# Altium schematic sheet NVME.SchDoc
size B; SheetNumber: 9; SheetTotal: 10
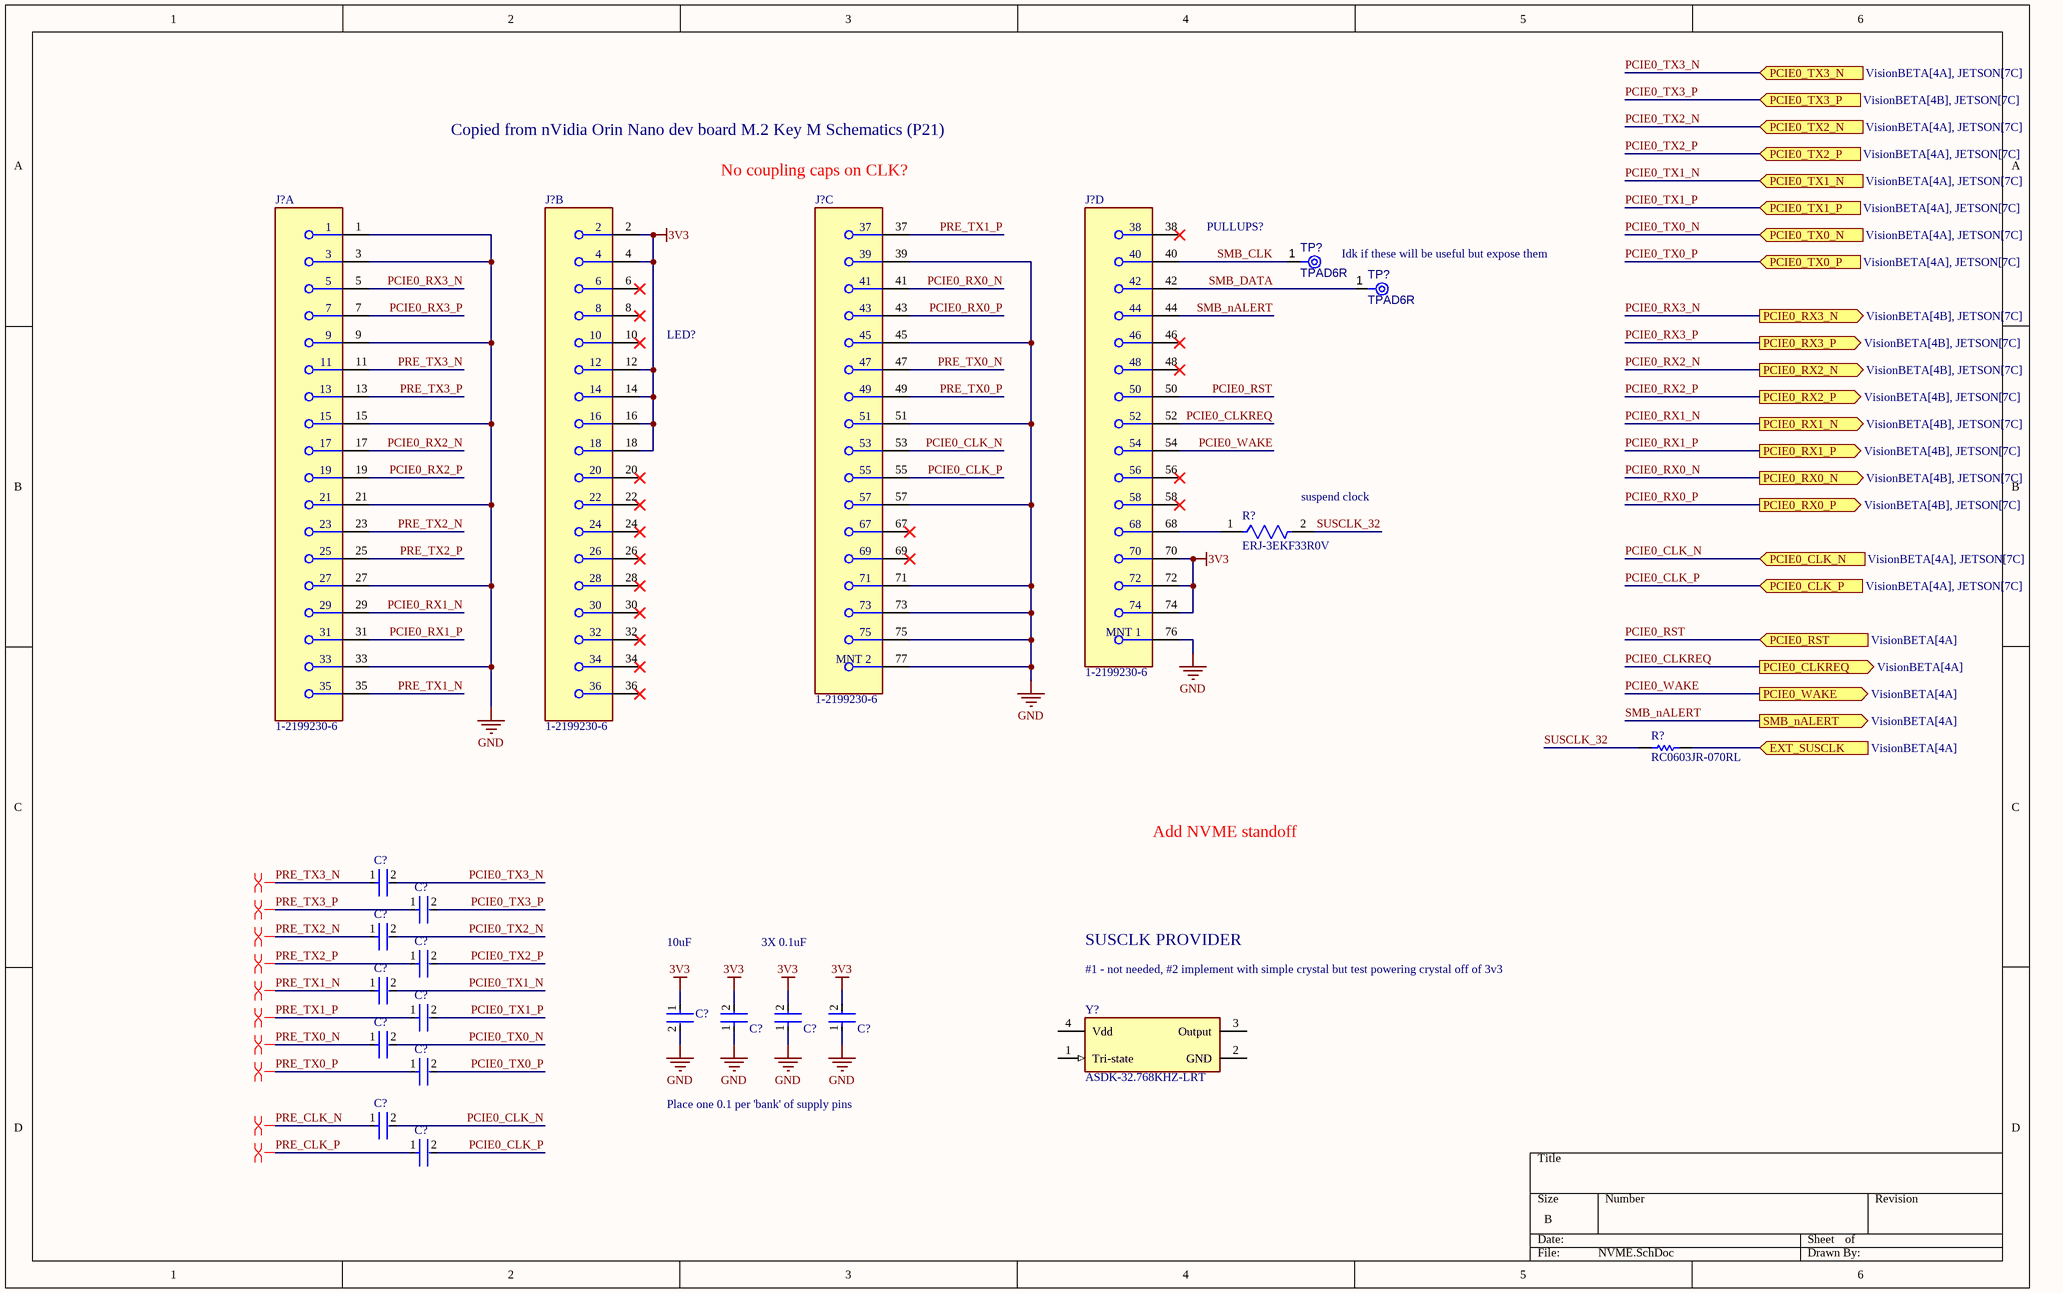
[diagram p0: NVME.SchDoc]

## Parts
(Parts that share a designator on the sheet are numbered #1, #2 ... from top to bottom, then left to right.)
C?#1  C1005X7R1A224K050BB  [FP-C1005-050-0_05-IPC_C]  (value not drawn)
C?#2  C1005X7R1A224K050BB  [FP-C1005-050-0_05-IPC_C]  (value not drawn)
C?#3  C1005X7R1A224K050BB  [FP-C1005-050-0_05-IPC_C]  (value not drawn)
C?#4  C1005X7R1A224K050BB  [FP-C1005-050-0_05-IPC_C]  (value not drawn)
C?#5  C1005X7R1A224K050BB  [FP-C1005-050-0_05-IPC_C]  (value not drawn)
C?#6  GRM188R60J106ME47D  [FP-GRM188-0_1-e0_2_0_55-IPC_A]  (value not drawn)
C?#7  C1005X7R1A224K050BB  [FP-C1005-050-0_05-IPC_C]  (value not drawn)
C?#8  C1005X7R1H104K050BB  [FP-C1005-050-0_05-IPC_C]  (value not drawn)
C?#9  C1005X7R1H104K050BB  [FP-C1005-050-0_05-IPC_C]  (value not drawn)
C?#10  C1005X7R1H104K050BB  [FP-C1005-050-0_05-IPC_C]  (value not drawn)
C?#11  C1005X7R1A224K050BB  [FP-C1005-050-0_05-IPC_C]  (value not drawn)
C?#12  C1005X7R1A224K050BB  [FP-C1005-050-0_05-IPC_C]  (value not drawn)
C?#13  C1005X7R1A224K050BB  [FP-C1005-050-0_05-IPC_C]  (value not drawn)
C?#14  C1005X7R1A224K050BB  [FP-C1005-050-0_05-IPC_C]  (value not drawn)
J?#1  1-2199230-6  [FP-1-2199230-6-MFG]  (part A of 4)
J?#2  1-2199230-6  [FP-1-2199230-6-MFG]  (part B of 4)
J?#3  1-2199230-6  [FP-1-2199230-6-MFG]  (part C of 4)
J?#4  1-2199230-6  [FP-1-2199230-6-MFG]  (part D of 4)
R?#1  ERJ-3EKF33R0V  [FP-ERJ3EK-MFG]
R?#2  RC0603JR-070RL  [RESC1608X55X25ML10T15]
TP?#1  TPAD6R  [TP06R]  (no BOM)
TP?#2  TPAD6R  [TP06R]  (no BOM)
Y?  ASDK-32.768KHZ-LRT  [FP-ASDK-MFG]

## Ports
EXT_SUSCLK (in, see VisionBETA[4A]), PCIE0_CLK_N (in, see VisionBETA[4A], JETSON[7C]), PCIE0_CLK_P (in, see VisionBETA[4A], JETSON[7C]), PCIE0_CLKREQ (out, see VisionBETA[4A]), PCIE0_RST (in, see VisionBETA[4A]), PCIE0_RX0_N (out, see VisionBETA[4B], JETSON[7C]), PCIE0_RX0_P (out, see VisionBETA[4B], JETSON[7C]), PCIE0_RX1_N (out, see VisionBETA[4B], JETSON[7C]), PCIE0_RX1_P (out, see VisionBETA[4B], JETSON[7C]), PCIE0_RX2_N (out, see VisionBETA[4B], JETSON[7C]), PCIE0_RX2_P (out, see VisionBETA[4B], JETSON[7C]), PCIE0_RX3_N (out, see VisionBETA[4B], JETSON[7C]), PCIE0_RX3_P (out, see VisionBETA[4B], JETSON[7C]), PCIE0_TX0_N (in, see VisionBETA[4A], JETSON[7C]), PCIE0_TX0_P (in, see VisionBETA[4A], JETSON[7C]), PCIE0_TX1_N (in, see VisionBETA[4A], JETSON[7C]), PCIE0_TX1_P (in, see VisionBETA[4A], JETSON[7C]), PCIE0_TX2_N (in, see VisionBETA[4A], JETSON[7C]), PCIE0_TX2_P (in, see VisionBETA[4A], JETSON[7C]), PCIE0_TX3_N (in, see VisionBETA[4A], JETSON[7C]), PCIE0_TX3_P (in, see VisionBETA[4B], JETSON[7C]), PCIE0_WAKE (out, see VisionBETA[4A]), SMB_nALERT (out, see VisionBETA[4A])

## Nets
3V3: C?#6.1 C?#8.2 C?#9.2 C?#10.2 J?#2.2 J?#2.4 J?#2.12 J?#2.14 J?#2.16 J?#2.18 J?#4.70 J?#4.72 J?#4.74
GND: C?#6.2 C?#8.1 C?#9.1 C?#10.1 J?#1.1 J?#1.3 J?#1.9 J?#1.15 J?#1.21 J?#1.27 J?#1.33 J?#3.39 J?#3.45 J?#3.51 J?#3.57 J?#3.71 J?#3.73 J?#3.75 J?#3.77(MNT_2) J?#4.76(MNT_1)
EXT_SUSCLK: R?#2.2 ; port EXT_SUSCLK
PCIE0_CLK_N: C?#13.2 J?#3.53 ; port PCIE0_CLK_N
PCIE0_CLK_P: C?#14.2 J?#3.55 ; port PCIE0_CLK_P
PCIE0_CLKREQ: J?#4.52 ; port PCIE0_CLKREQ
PCIE0_RST: J?#4.50 ; port PCIE0_RST
PCIE0_RX0_N: J?#3.41 ; port PCIE0_RX0_N
PCIE0_RX0_P: J?#3.43 ; port PCIE0_RX0_P
PCIE0_RX1_N: J?#1.29 ; port PCIE0_RX1_N
PCIE0_RX1_P: J?#1.31 ; port PCIE0_RX1_P
PCIE0_RX2_N: J?#1.17 ; port PCIE0_RX2_N
PCIE0_RX2_P: J?#1.19 ; port PCIE0_RX2_P
PCIE0_RX3_N: J?#1.5 ; port PCIE0_RX3_N
PCIE0_RX3_P: J?#1.7 ; port PCIE0_RX3_P
PCIE0_TX0_N: C?#11.2 ; port PCIE0_TX0_N
PCIE0_TX0_P: C?#12.2 ; port PCIE0_TX0_P
PCIE0_TX1_N: C?#5.2 ; port PCIE0_TX1_N
PCIE0_TX1_P: C?#7.2 ; port PCIE0_TX1_P
PCIE0_TX2_N: C?#3.2 ; port PCIE0_TX2_N
PCIE0_TX2_P: C?#4.2 ; port PCIE0_TX2_P
PCIE0_TX3_N: C?#1.2 ; port PCIE0_TX3_N
PCIE0_TX3_P: C?#2.2 ; port PCIE0_TX3_P
PCIE0_WAKE: J?#4.54 ; port PCIE0_WAKE
PRE_CLK_N: C?#13.1
PRE_CLK_P: C?#14.1
PRE_TX0_N: C?#11.1 J?#3.47
PRE_TX0_P: C?#12.1 J?#3.49
PRE_TX1_N: C?#5.1 J?#1.35
PRE_TX1_P: C?#7.1 J?#3.37
PRE_TX2_N: C?#3.1 J?#1.23
PRE_TX2_P: C?#4.1 J?#1.25
PRE_TX3_N: C?#1.1 J?#1.11
PRE_TX3_P: C?#2.1 J?#1.13
SMB_CLK: J?#4.40 TP?#1.1(TP)
SMB_DATA: J?#4.42 TP?#2.1(TP)
SMB_nALERT: J?#4.44 ; port SMB_nALERT
SUSCLK_32: R?#1.2 R?#2.1
NetJ?#4_68: J?#4.68 R?#1.1

Not connected (* = marked no-connect by the designer): J?#2 6* 8* 10* 20* 22* 24* 26* 28* 30* 32* 34* 36*; J?#3 67* 69*; J?#4 38* 46* 48* 56* 58*; Y? 1(Tri-state) 2(GND) 3(Output) 4(Vdd)

## Layout directives
differential pair: PRE_CLK_N, PRE_CLK_P, PRE_TX0_N, PRE_TX0_P, PRE_TX1_N, PRE_TX1_P, PRE_TX2_N, PRE_TX2_P, PRE_TX3_N, PRE_TX3_P

## Notes on the sheet
- Copied from nVidia Orin Nano dev board M.2 Key M Schematics (P21)
- No coupling caps on CLK?
- PULLUPS?
- (near TP?#2) Idk if these will be useful but expose them
- LED?
- (near R?#1) suspend clock
- Add NVME standoff
- 10uF
- 3X 0.1uF
- SUSCLK PROVIDER
- #1 - not needed, #2 implement with simple crystal but test powering crystal off of 3v3
- Place one 0.1 per 'bank' of supply pins

## Library data of the parts
C?#1-C?#5 C?#7 C?#11-C?#14 = CMP-08246-006072-1: Multilayer Ceramic Capacitors 220nF ±10% 10V X7R SMD 0402; Resistor Type: Ceramic; Dielectric: X7R; Voltage Rating (DC): 10V; Width: 0.02inch; Case Code (Metric): 1005; Mount: Surface Mount; Termination: SMD/SMT; Series: C; Tolerance: 10%; Depth: 0.5mm; Length: 1mm; Packaging: Tape and Reel; Radiation Hardening: No; Weight: 2.3E-05oz; Voltage Rating: 10V; Thickness: 0.022inch; Capacitance: 220nF; Case Code (Imperial): 0402; Lead Free: Lead Free; Case/Package: 0402; Package Quantity: 10000; Dielectric Material: Ceramic; RoHS Compliant: Yes; REACH SVHC: No SVHC; Min Operating Temperature: -55°C; Max Operating Temperature: 125°C; Height: 0.5mm; Construction: Flat
C?#6 = CMP-2006-02792-2: Chip Multilayer Ceramic Capacitors for General Purpose, 0603, 10uF, X5R, 15%, 20%, 6.3V; Packaging: Tape and Reel; Voltage Rating (DC): 6.3V; Width: 0.031inch; Termination: SMD/SMT; Dielectric: X5R; Package Quantity: 4000; Voltage Rating: 6.3V; Capacitance: 10uF; Case/Package: 0603; Min Operating Temperature: -55°C; Voltage: 6.3V; Length: 1.6mm; Thickness: 0.035inch; Lead Free: Lead Free; Depth: 0.8mm; Case Code (Imperial): 0603; Max Operating Temperature: 85°C; Material: Ceramic; Height: 0.8mm; Tolerance: 20%; Mount: Surface Mount; REACH SVHC: No SVHC; Radiation Hardening: No; Case Code (Metric): 1608
C?#8-C?#10 = CMP-2000-05393-2: Multilayer Ceramic Capacitors 100nF ±10% 50V X7R SMD 0402; Voltage: 50V; Dielectric Material: Ceramic; Min Operating Temperature: -55°C; Depth: 0.5mm; Radiation Hardening: No; RoHS Compliant: Yes; Voltage Rating (DC): 50V; Lead Free: Lead Free; Resistor Type: Ceramic; Height: 0.5mm; Dielectric: X7R; Thickness: 0.022inch; Case/Package: 0402; Case Code (Metric): 1005; Termination: SMD/SMT; Capacitance: 100nF; Packaging: Tape and Reel; Max Operating Temperature: 125°C; Mount: Surface Mount; Package Quantity: 1; Width: 0.02inch; Weight: 2.3E-05oz; Voltage Rating: 50V; Tolerance: 10%; Construction: Flat; Case Code (Imperial): 0402; Length: 1mm; REACH SVHC: No SVHC; Series: C
J?#1-J?#4 = CMP-03365-000001-1: CONN EDGE DUAL FMALE 67POS 0.020; Manufacturer: TE; Number Of Contacts: 67; Current Rating: 0.5A; Pitch: 0.5mm; Conn Gender: Female; Is Female: yes; Voltage Rating: 50V; Conn Orientation: Right Angle; Automotive: No; Temperature Range High: +80°C; Package: 1-2199230-6; Category: Conn; Temperature: -40°C to +80°C; Number Of Rows: 2; ComponentLink2URL: http://www.te.com/commerce/DocumentDelivery/DDEController?Action=showdoc&DocId=Specification+Or+Standard%7F114-115006%7FB%7Fpdf%7FEnglish%7FENG_SS_114-115006_B_114-115006_REV_B.pdf%7F1-2199230-6; Manufacturer Part Number: 1-2199230-6; Height: 4.2mm; RoHS: TRUE; Footprint Url: http://www.te.com/commerce/DocumentDelivery/DDEController?Action=showdoc&DocId=Customer+Drawing%7F2199230%7FB2%7Fpdf%7FEnglish%7FENG_CD_2199230_B2.pdf%7F1-2199230-6; Digikey Description: CONN EDGE DUAL FMALE 67POS 0.020; Device Class L2: Card Edge Connectors; Contact Material: Gold,Tin; Device Class L1: Connectors; Device Class L3: unset; ComponentLink2Description: Datasheet; Temperature Range Low: -40°C; Octopart: https://octopart.com/1-2199230-6-te+connectivity-34969376; Lead Free: Yes
R?#1 = CMP-2000-00443-2: RES SMD 33 OHM 1% 1/10W 0603; Voltage Rating (DC): 75V; Power Rating: 100mW; Resistance: 33R; Temperature Coefficient: 100ppm/°C; Min Operating Temperature: -55°C; Packaging: Tape and Reel; Mount: Surface Mount; Lead Free: Lead Free; Voltage Rating: 75V; Features: Automotive AEC-Q200; Height: 0.022inch; Width: 0.031inch; Number of Pins: 2; Package Quantity: 1; Case Code (Metric): 1608; Max Power Dissipation: 100mW; Case Code (Imperial): 0603; Termination: SMD/SMT; Resistance Tolerance: 1%; Max Operating Temperature: 155°C; Tolerance: 1%; Length: 1.6mm; Case/Package: 0603; Military Standard: Not; RoHS Compliant: Yes; Series: ERJ; Size Code: 0603; Construction: Rectangular; Number of Terminations: 2; Radiation Hardening: No; Resistor Type: Thick Film; Contact Plating: Tin; Depth: 0.8mm; REACH SVHC: No SVHC
R?#2 = CMP-2100-03667-1: Chip Resistor, 0 Ohm, +/- 5%, 0.1 W, -55 to 155 degC, 0603 (1608 Metric), RoHS, Tape and Reel; Manufacturer: Yageo; Temperature Coefficient: 200ppm/degreesC; Voltage Rating: 50V; Power Rating: 100mW; Resistance: 0mOhm; Width: 0.8mm; Max Operating Temperature: 155degC; Tolerance: 5%; Package Reference: 0603; Height: 0.45mm; Depth: 0.8mm; Package Description: 2-Pin Surface Mount Device, Body 1.6 x 0.8 mm; Termination: SMD/SMT; Package Quantity: 5000; Case/Package: 0603; Case Code (Imperial): 0603; Radiation Hardening: No; Number of Pins: 2; Length: 1.6mm; Lead Free: LeadFree; Voltage Rating (DC): 50V; Military Standard: Not; Datasheet URL: http://www.yageo.com/NewPortal/yageodocoutput?fileName=/pdf/R-Chip/PYu-RC_Group_51_RoHS_L_5.pdf; Manufacturer URL: http://www.yageo.com/; Packaging: TapeandReel; Case Code (Metric): 1608; Min Operating Temperature: -55degC; Composition: ThickFilm; RoHSCompliant: true; Contact Plating: Tin; Datasheet Version: Rev. 5, 10/2016; REACH SVHC: NoSVHC
TP?#1 TP?#2 = CMP-00028-00002-2: 0.6mm round; Pins: 1
Y? = CMP-27762-001115-1: XTAL OSC XO 32.7680KHZ CMOS SMD; Load Capacitance: 15pF; Max Supply Current: 3.5mA; Min Supply Voltage: 2.97V; Operating Supply Voltage: 3.3V; Frequency Stability: 25ppm; Lead Free: Lead Free; Case/Package: CSMD; Number of Pins: 4; Max Operating Temperature: 85°C; Packaging: Tape and Reel; Width: 0.079inch; Min Operating Temperature: -40°C; Radiation Hardening: No; Length: 2.5mm; Depth: 2mm; Termination: SMD/SMT; Height: 0.037inch; Series: ASDK; Frequency: 32.768kHz; Mount: Surface Mount